# Altium schematic sheet 6_电子天平_RS485&RS232.SchDoc: 电子天平_RS485&RS232
size A4; Date: 2020/01/07; ApprovedBy: Riggin; CheckedBy: Riggin; Author: Riggin; DrawnBy: Riggin; Engineer: Riggin; DocumentNumber: 7; Revision: V1.0; SheetNumber: 7; SheetTotal: 8; Time: 14:09:34; ProjectName: 电子天平
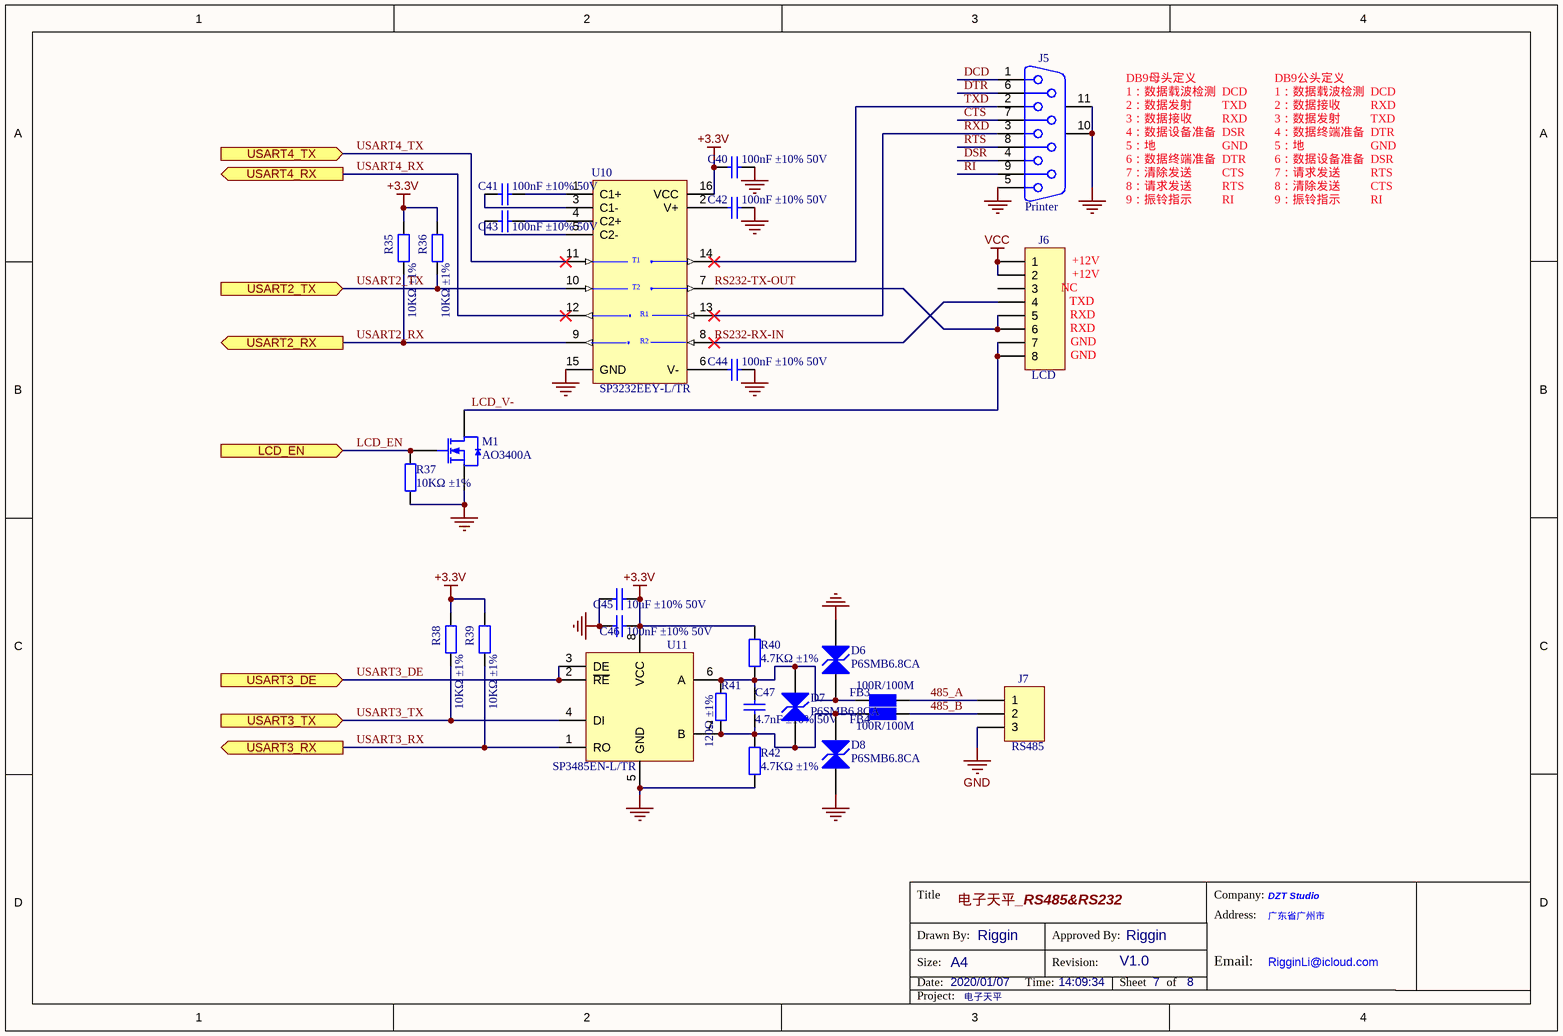
[diagram p0: 6_电子天平_RS485&RS232.SchDoc]

## Parts
C40  100nF ±10% 50V  [LC-0603_C]
C41  100nF ±10% 50V  [LC-0603_C]
C42  100nF ±10% 50V  [LC-0603_C]
C43  100nF ±10% 50V  [LC-0603_C]
C44  100nF ±10% 50V  [LC-0603_C]
C45  10uF ±10% 50V  [LC-1206_C]
C46  100nF ±10% 50V  [LC-0805_C]
C47  4.7nF ±10% 50V  [LC-0805_C]
D6  P6SMB6.8CA  [LC-SMB(DO-214AA)_S1]
D7  P6SMB6.8CA  [LC-SMB(DO-214AA)_S1]
D8  P6SMB6.8CA  [LC-SMB(DO-214AA)_S1]
FB3  100R/100M  [LC-0805_L]
FB4  100R/100M  [LC-0805_L]
J5  Printer  [CON-DB9_Female]
J6  LCD  [CON-A2505WR-8P]
J7  RS485
M1  AO3400A  [LC-SOT-23(SOT-23-3)]
R35  10KΩ ±1%  [LC-0805_R]
R36  10KΩ ±1%  [LC-0805_R]
R37  10KΩ ±1%  [LC-0805_R]
R38  10KΩ ±1%  [LC-0805_R]
R39  10KΩ ±1%  [LC-0805_R]
R40  4.7KΩ ±1%  [LC-0805_R]
R41  120Ω ±1%  [LC-0805_R]
R42  4.7KΩ ±1%  [LC-0805_R]
U10  SP3232EEY-L/TR  [LC-TSSOP-16]
U11  SP3485EN-L/TR  [LC-SOIC-8_150mil]

## Ports
LCD_EN (in), USART2_RX (out), USART2_TX (in), USART3_DE (in), USART3_RX (out), USART3_TX (in), USART4_RX (out), USART4_TX (in)

## Nets
+3.3V: C40.2 C45.2 C46.1 R35.1 R36.1 R38.1 R39.1 R40.2 U10.16(VCC) U11.8(VCC)
GND: C40.1 C42.2 C44.2 C45.1 C46.2 D6.1(A) D8.1(A) J5.5 J5.10(MH1) J5.11(MH2) J7.3 M1.2(S) R37.2 R42.1 U10.15(GND) U11.5(GND)
VCC: J6.1 J6.2
485_A: FB3.1 J7.1
485_B: FB4.1 J7.2
CTS: J5.7
DCD: J5.1
DSR: J5.4
DTR: J5.6
LCD_EN: M1.1(G) R37.1 ; port LCD_EN
LCD_V-: J6.7 J6.8 M1.3(D)
RI: J5.9
RS232-RX-IN: J6.4 U10.8(R2IN)
RS232-TX-OUT: J6.5 J6.6 U10.7(T2OUT)
RTS: J5.8
RXD: J5.3 U10.13(R1IN)
TXD: J5.2 U10.14(T1OUT)
USART2_RX: R35.2 U10.9(R2OUT) ; port USART2_RX
USART2_TX: R36.2 U10.10(T2IN) ; port USART2_TX
USART3_DE: U11.2(~{RE}) U11.3(DE) ; port USART3_DE
USART3_RX: R39.2 U11.1(RO) ; port USART3_RX
USART3_TX: R38.2 U11.4(DI) ; port USART3_TX
USART4_RX: U10.12(R1OUT) ; port USART4_RX
USART4_TX: U10.11(T1IN) ; port USART4_TX
NetC41_1: C41.1 U10.3(C1-)
NetC41_2: C41.2 U10.1(C1+)
NetC42_1: C42.1 U10.2(V+)
NetC43_1: C43.1 U10.5(C2-)
NetC43_2: C43.2 U10.4(C2+)
NetC44_1: C44.1 U10.6(V-)
NetC47_1: C47.1 D7.2(K) D8.2(K) FB4.2 R41.1 R42.2 U11.7(B)
NetC47_2: C47.2 D6.2(K) D7.1(A) FB3.2 R40.1 R41.2 U11.6(A)

Not connected (* = marked no-connect by the designer): J6 3

## Notes on the sheet
- 1：数据载波检测  DCD
- 2：数据发射          TXD
- DB9母头定义
- 2：数据接收          RXD
- DB9公头定义
- 3：数据接收          RXD
- 6：数据终端准备  DTR
- 5：地                      GND
- 4：数据设备准备  DSR
- 7：清除发送          CTS
- 3：数据发射          TXD
- 4：数据终端准备  DTR
- 6：数据设备准备  DSR
- 7：请求发送          RTS
- 8：请求发送          RTS
- 9：振铃指示          RI
- 8：清除发送          CTS
- (near J6) NC
- (near J6) TXD
- (near J6) +12V
- (near J6) RXD
- (near J6) GND
- Title
- Company:
- Address:
- 广东省广州市
- DZT Studio
- Size:
- Date:
- Drawn By:
- A4
- Riggin
- Time:
- Revision:
- Approved By:
- Sheet
- of
- Email:
- RigginLi@icloud.com
- Project:
- (in symbol MAX232AESE) T1; T2; R1; R2

## Library data of the parts
C40-C47 = Cap: MLCC; Value: 100pF; Published: 8-Jun-2000; LatestRevisionDate: 17-Jul-2002; LatestRevisionNote: Re-released for DXP Platform.; PackageReference: RAD-0.3; Publisher: Altium Limited; PackageDescription: Radial Cap, Thru-Hole; 2 Leads; 0.3 in Pin Spacing
D6-D8 = SMB/DO-214AA P6SMB6.8CA: TVS; ComponentLink1Description: 供应商链接; ComponentLink1URL: http://www.szlcsc.com/product/details_79530.html; Package: SMB/DO-214AA; Supplier: LC; SuppliersPartNumber: C78395
FB3 FB4 = FB: 磁珠
J5 = D Connector 9: Receptacle Assembly, 9 Position, Right Angle; PackageDocument: O; Positions: 9; Published: 15-Jun-2001; LatestRevisionDate: 17-Jul-2002; LatestRevisionNote: Re-released for DXP Platform.; DatasheetDocument: 1-Sep-1999; PackageReference: 788750; Publisher: Altium Limited; Orientation: Right Angle; Gender: Receptacle
J6 = Header 8H: Header, 8-Pin, Right Angle; LatestRevisionDate: 17-Jul-2002; LatestRevisionNote: Re-released for DXP Platform.; Publisher: Altium Limited
J7 = Header 3: Header, 3-Pin; LatestRevisionDate: 17-Jul-2002; LatestRevisionNote: Re-released for DXP Platform.; Publisher: Altium Limited
M1 = AO3400A N道沟 X0YV1T SOT-23: MOS(场效应管); ComponentLink1Description: 供应商链接; ComponentLink1URL: http://www.szlcsc.com/product/details_21629.html; Package: SOT-23; Supplier: LC; SuppliersPartNumber: C20917
R35-R42 = Res2: Resistor; Value: 1K; Published: 8-Jun-2000; LatestRevisionDate: 17-Jul-2002; LatestRevisionNote: Re-released for DXP Platform.; PackageReference: AXIAL-0.4; Publisher: Altium Limited; PackageDescription: Axial Device, Thru-Hole; 2 Leads; 0.4 in Pin Spacing
U10 = MAX232AESE: +5V-Powered, Multichannel RS-232 Driver/Receiver; Published: 16-Jan-2001; LatestRevisionDate: 13-Apr-2006; LatestRevisionNote: IPC-7351 Footprint Added.; DatasheetVersion: Nov-1997; PackageReference: NSO16; Publisher: Altium Limited; PackageDescription: 16-Pin Small Outline Integrated Circuit 1.27 mm Pitch; Code_JEDEC: MS-012-AC; Code_IPC: SOIC127P600-16; ComponentLink1Description: Manufacturer Link; ComponentLink1URL: http://www.maxim-ic.com/; ComponentLink2Description: Datasheet; ComponentLink2URL: http://pdfserv.maxim-ic.com/en/ds/MAX220-MAX249.pdf
U11 = SP3485EN: RS485